# Altium schematic sheet SY55857L.V03.R00.SchDoc: Conversor de CMOS a LVPECL
size A4; SheetNumber: 10; SheetTotal: 18
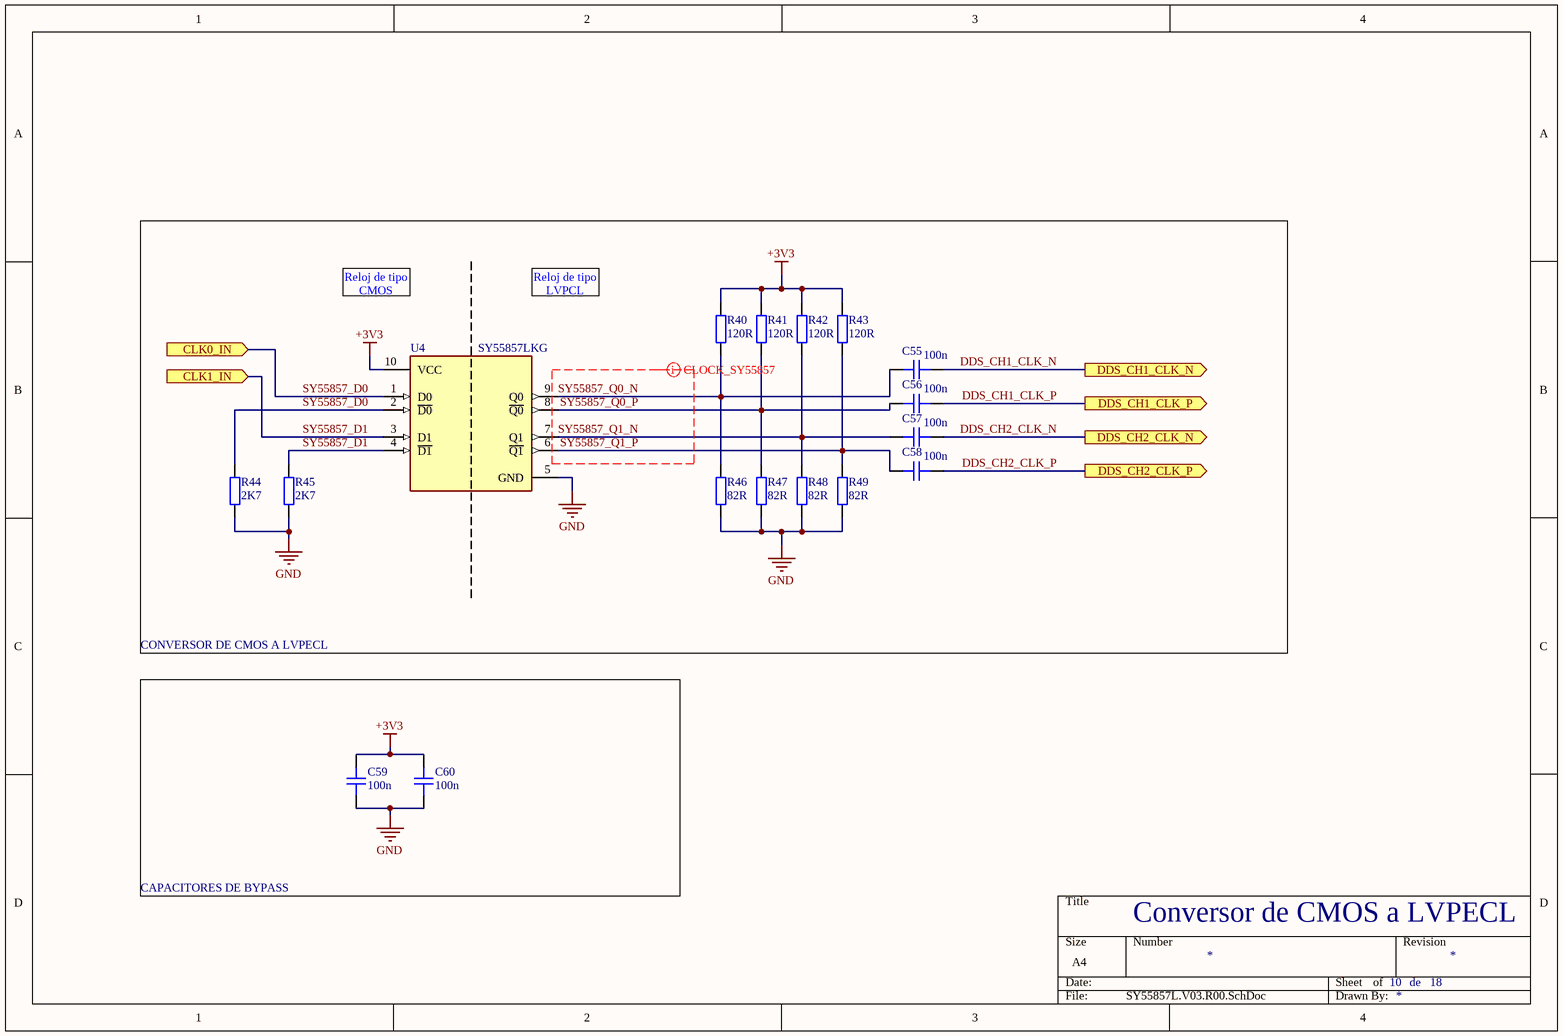
[diagram p0: SY55857L.V03.R00.SchDoc]

## Parts
C55  100n  [CAP_0805]
C56  100n  [CAP_0805]
C57  100n  [CAP_0805]
C58  100n  [CAP_0805]
C59  100n  [CAP_0805]
C60  100n  [CAP_0805]
R40  120R  [RES_0805]
R41  120R  [RES_0805]
R42  120R  [RES_0805]
R43  120R  [RES_0805]
R44  2K7  [RES_0805]
R45  2K7  [RES_0805]
R46  82R  [RES_0805]
R47  82R  [RES_0805]
R48  82R  [RES_0805]
R49  82R  [RES_0805]
U4  SY55857LKG  [FP-K10-1-IPC_A]

## Blocks framed on the sheet
CONVERSOR DE CMOS A LVPECL: C55-C58 R40-R49 U4
CAPACITORES DE BYPASS: C59 C60

## Ports
CLK0_IN (in), CLK1_IN (in), DDS_CH1_CLK_N (out), DDS_CH1_CLK_P (out), DDS_CH2_CLK_N (out), DDS_CH2_CLK_P (out)

## Nets
+3V3: C59.2 C60.2 R40.2 R41.2 R42.2 R43.2 U4.10(VCC)
GND: C59.1 C60.1 R44.2 R45.2 R46.1 R47.1 R48.1 R49.1 U4.5(GND)
DDS_CH1_CLK_N: C55.1 ; port DDS_CH1_CLK_N
DDS_CH1_CLK_P: C56.1 ; port DDS_CH1_CLK_P
DDS_CH2_CLK_N: C57.1 ; port DDS_CH2_CLK_N
DDS_CH2_CLK_P: C58.1 ; port DDS_CH2_CLK_P
SY55857_D0: U4.1(D0) ; port CLK0_IN
SY55857_D1: U4.3(D1) ; port CLK1_IN
SY55857_~{D0}: R44.1 U4.2(~{D0})
SY55857_~{D1}: R45.1 U4.4(~{D1})
SY55857_Q0_N: C55.2 R40.1 R46.2 U4.9(Q0)
SY55857_Q0_P: C56.2 R41.1 R47.2 U4.8(~{Q0})
SY55857_Q1_N: C57.2 R42.1 R48.2 U4.7(Q1)
SY55857_Q1_P: C58.2 R43.1 R49.2 U4.6(~{Q1})

## Layout directives
differential pair; differential pair class CLOCK_SY55857; net class CLOCK_SY55857; rule Matched Net Lengths [Tolerance = 0.25mm]: SY55857_Q0_N, SY55857_Q0_P, SY55857_Q1_N, SY55857_Q1_P

## Notes on the sheet
- Reloj de tipo CMOS
- Reloj de tipo LVPCL
- de

## Library data of the parts
C55-C60 = CAP_0805: Capacitor SMD 0805; Manufacturer: *; Manufacturer Part Number: *; Distributor Link: *; LCSC: *; Rating: *; Dielectric: *
R40-R49 = RES_0805: Resistor SMD 0805; Manufacturer: *; Manufacturer Part Number: *; Distributor Link: *; LCSC: *
U4 = CMP-00252-66526369-1: SY55857LKG SY55857L Series 3.3 V 2.5 Gbps ANY INPUT-to-LVPECL Dual Translator - MSOP-10; Number of Channels: 2; Min Supply Voltage: 3V; Number of Circuits: 1; Frequency: 2.5GHz; Max Supply Voltage: 3.6V; Operating Supply Voltage: 3.3V; Nominal Supply Current: 28mA; Rise Time: 200ps; Low Level Output Current: 50mA; Turn-On Delay Time: 400ps; High Level Output Current: -50mA; Channel Type: Unidirectional; Mount: Surface Mount; REACH SVHC: No SVHC; Number of Outputs: 1; Max Operating Temperature: 85°C; Height: 920µm; Termination: SMD/SMT; Number of Inputs: 1; Width: 3mm; Logic Function: Translator; Min Operating Temperature: -40°C; Ambient Temperature Range High: 85°C; Lead Free: Lead Free; Schedule B: 8542320050; Propagation Delay: 400ps; Radiation Hardening: No; Number of Pins: 10; Lifecycle Status: Production; Length: 3mm; NexarPartId: 66526369; RoHS: Compliant; Packaging: Bulk; Data Rate: 2.5Gbps; Case/Package: MSOP